# Altium project LF_v5_MainPCB.PrjPcb
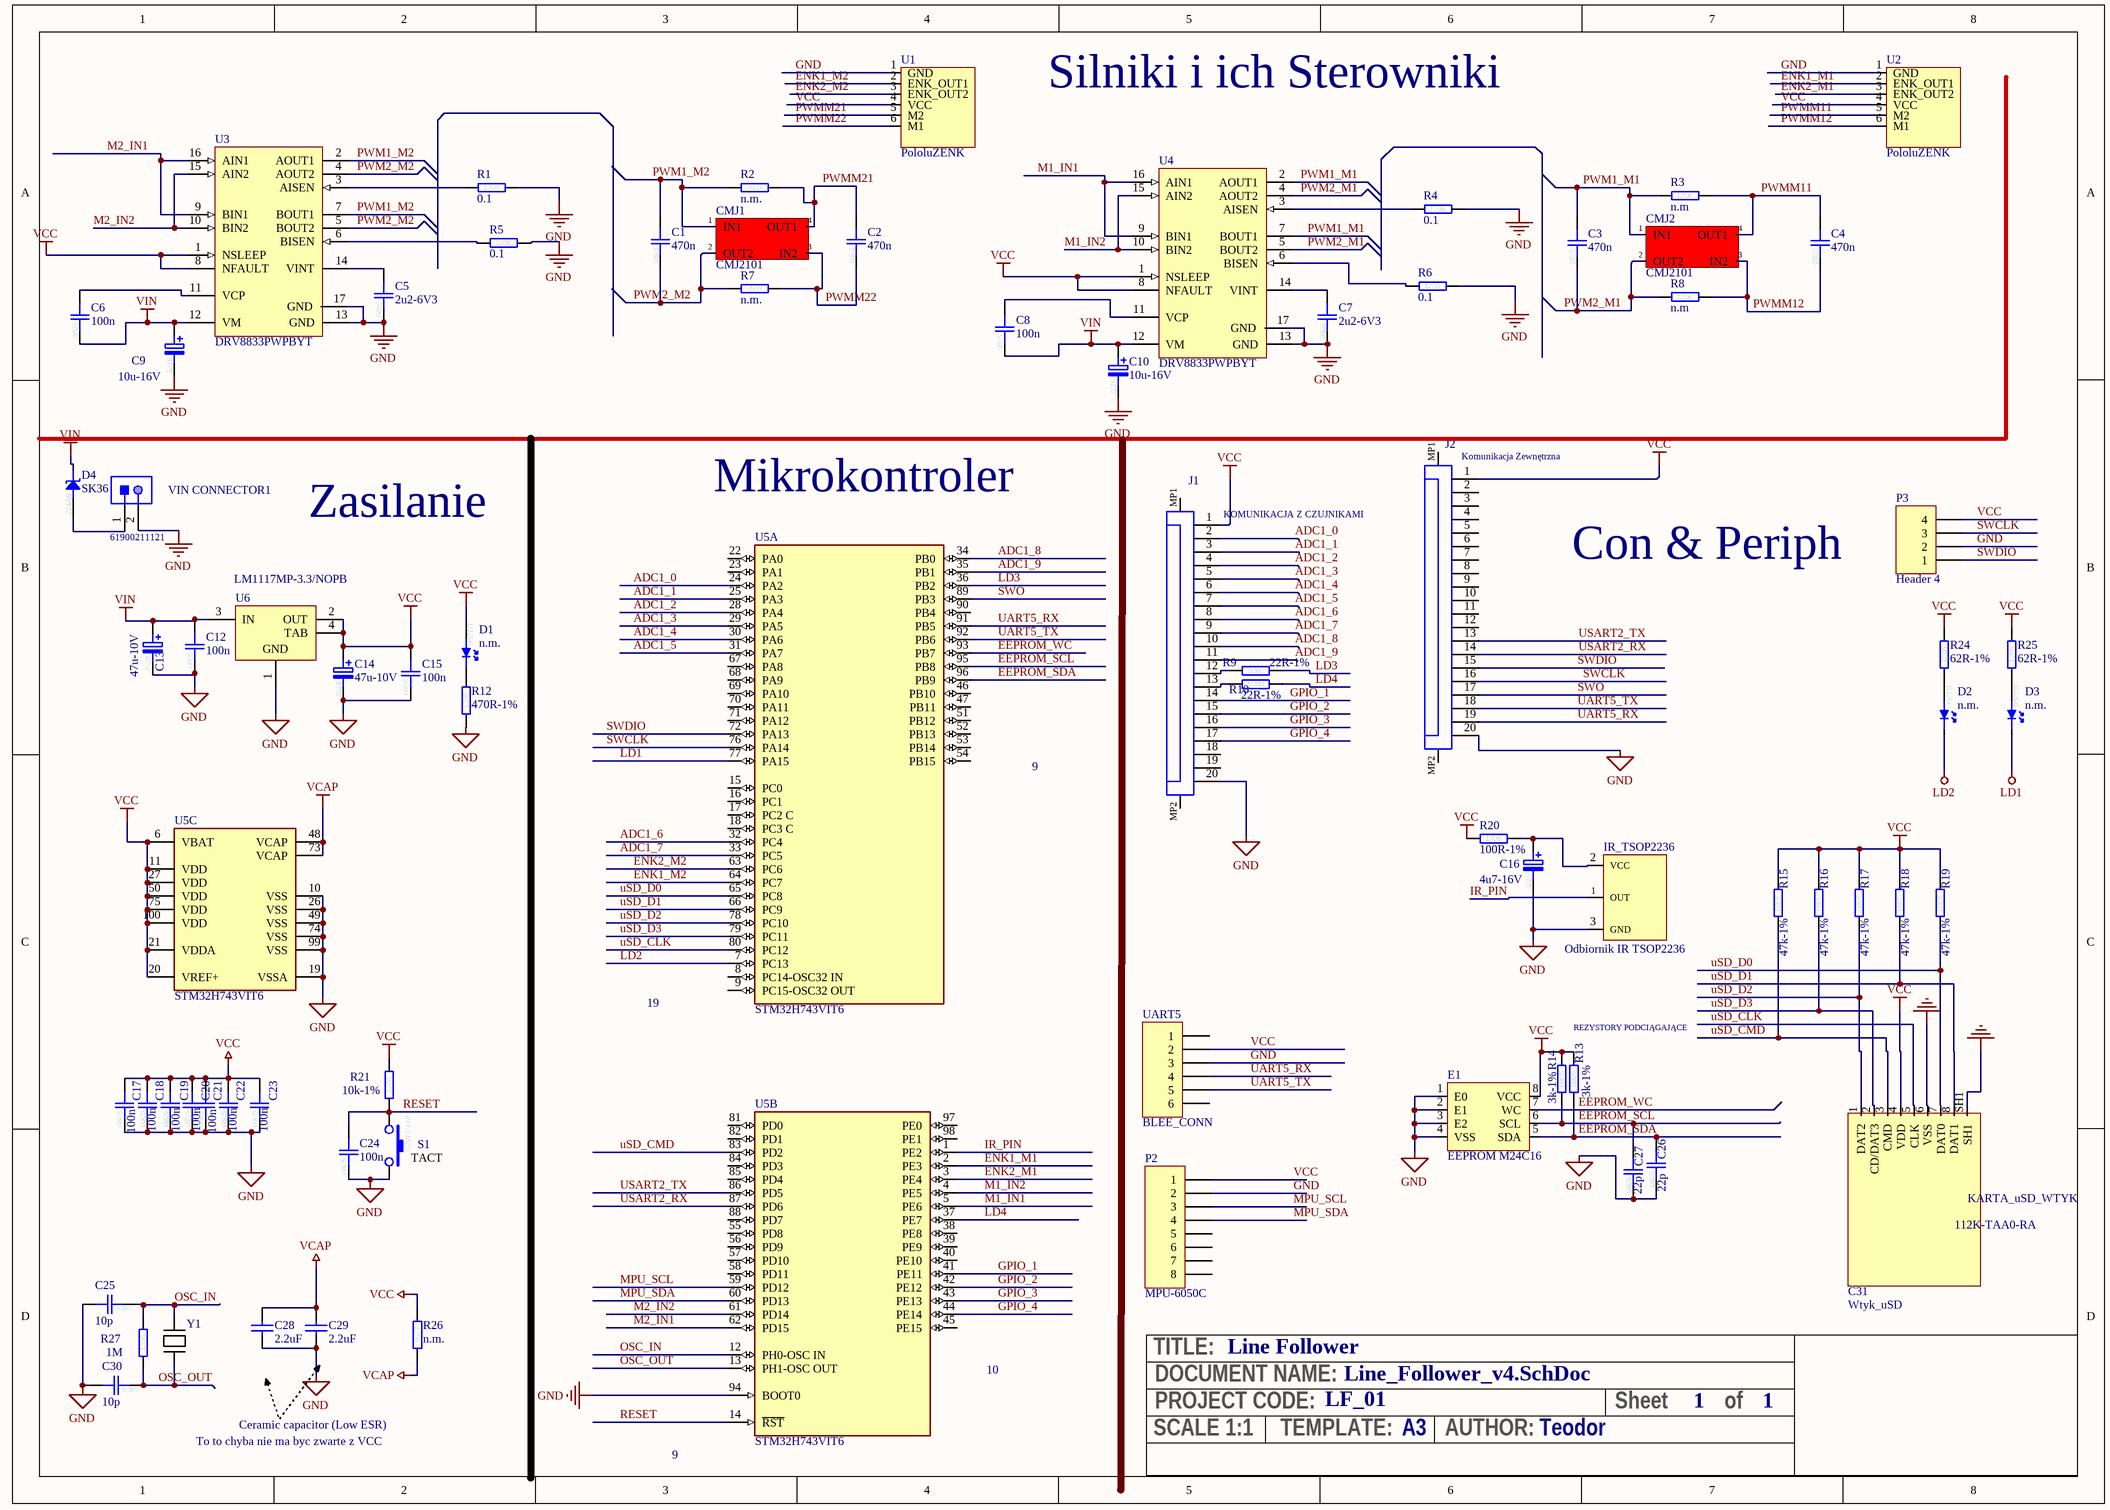
[diagram p0: Line_Follower_v4.SchDoc]
6 sheets, 152 parts. Net scope: hierarchical (ports join the sheet entries above them; power ports are global).
Board file: LF_v5.PcbDoc
Sheets:
  Line_Follower_v4.SchDoc
  Line_Follower_v5.SchDoc
    Connectors = Connectors&Periph.SchDoc
    Motor_Driver = Motor_Driver.SchDoc
    Microcontroller = Microcontroller.SchDoc
    Power = Power.SchDoc

## Sheet Line_Follower_v4.SchDoc: Line Follower
size A3; Autor: Teodor; Dopisek: Cel:; Cel: Ehh; Projektant: Teodor; Author: Teodor; DocumentNumber: 1; SheetNumber: 1; SheetTotal: 1; PROJECT CODE: LF_01

### Parts
(Parts that share a designator on the sheet are numbered #1, #2 ... from top to bottom, then left to right.)
C1#1  470n  [0805C]
C2#1  470n  [0805C]
C3#1  470n  [0805C]
C4#1  470n  [0805C]
C5#1  2u2-6V3  [0805C]
C6#1  100n  [0805C]
C7#1  2u2-6V3  [0805C]
C8#1  100n  [0805C]
C9#1  10u-16V  [3216-SMDA]
C10#1  10u-16V  [3216-SMDA]
C12#1  100n  [0805C]
C13#1  47u-10V  [3528-SMDB]
C14#1  47u-10V  [3528-SMDB]
C15#1  100n  [0805C]
C16  4u7-16V  [3216-SMDA]
C17#1  100n  [0805C]
C18#1  100n  [0805C]
C19#1  100n  [0805C]
C20#1  100n  [0805C]
C21#1  100n  [0805C]
C22#1  100n  [0805C]
C23#1  100n  [0805C]
C24#1  100n  [0805C]
C25#1  10p  [0805C]
C26#1  22p  [0805C]
C27#1  22p  [0805C]
C28#1  2.2uF  [1206C]
C29#1  2.2uF  [1206C]
C30#1  10p  [0805C]
C31  Wtyk_uSD  [112K-TAA0-RA1]
CMJ1#1  CMJ2101  [CMJ2101FP]
CMJ2#1  CMJ2101  [CMJ2101FP]
D1#1  n.m.  [D1206]  (no BOM)
D2#1  n.m.  [D1206]  (no BOM)
D3#1  n.m.  [D1206]  (no BOM)
D4#1  SK36  [DO214AB]
E1#1  EEPROM M24C16  [SOP8EEPROM]
IR_TSOP2236#1  Odbiornik IR TSOP2236  [TSOP2236FP]
J1#1  KOMUNIKACJA Z CZUJNIKAMI  [687120183722]
J2#1  Komunikacja Zewnętrzna  [687120183722]
P2#1  MPU-6050C  [HDR1X8]
P3#1  Header 4  [HDR1X4]
R1#1  0.1  [1206R]
R2#1  n.m.  [0603R]  (no BOM)
R3#1  n.m  [1206R]
R4#1  0.1  [1206R]
R5#1  0.1  [1206R]
R6#1  0.1  [1206R]
R7#1  n.m.  [0603R]  (no BOM)
R8#1  n.m  [1206R]
R9#1  22R-1%  [0805R]
R10#1  22R-1%  [0805R]
R12#1  470R-1%  [1206R]
R13#1  3k-1%  [0805R]
R14#1  3k-1%  [0805R]
R15#1  47k-1%  [0805R]
R16#1  47k-1%  [0805R]
R17#1  47k-1%  [0805R]
R18#1  47k-1%  [0805R]
R19#1  47k-1%  [0805R]
R20#1  100R-1%  [1206R]
R21#1  10k-1%  [1206R]
R24#1  62R-1%  [1206R]
R25#1  62R-1%  [1206R]
R26#1  n.m.  [1206R]  (no BOM)
R27#1  1M  [1206R]
S1#1  TACT  [INT-1187S_16]
U1#1  PololuZENK  [PololuzENK]
U2#1  PololuZENK  [PololuzENK]
U3#1  DRV8833PWPBYT  [DRV8833PWPBYTEOR]
U4#1  DRV8833PWPBYT  [DRV8833PWPBYTEOR]
U5#1  STM32H743VIT6  [FP-LQFP100-1L-MFG]  (parts A,B,C of 3)
U6#1  LM1117MP-3.3/NOPB  [DCY0004A_L]
UART5#1  BLEE_CONN  [HDR1X6]
VIN_CONNECTOR1#1  61900211121  [61900211121]
Y1#1  Rezonator_z_Botland  [Rezonator_z_Botlandu]  (value not drawn)

### Nets
GND: C5#1.2 C7#1.2 C9#1.2 C10#1.2 C12#1.2 C13#1.2 C14#1.2 C15#1.2 C16.2 C17#1.2 C18#1.2 C19#1.2 C20#1.2 C21#1.2 C22#1.2 C23#1.2 C24#1.2 C25#1.1 C26#1.2 C27#1.2 C28#1.1 C29#1.1 C30#1.1 C31.6(VSS) C31.SH1 E1#1.1(E0) E1#1.2(E1) E1#1.3(E2) E1#1.4(VSS) IR_TSOP2236#1.3(GND) J1#1.20 J2#1.20 P2#1.2 P3#1.2 R1#1.2 R4#1.2 R5#1.2 R6#1.2 R12#1.2 S1#1.2 U1#1.1(GND) U2#1.1(GND) U3#1.13(GND) U3#1.17(GND) U4#1.13(GND) U4#1.17(GND) U5#1.10(VSS) U5#1.19(VSSA) U5#1.26(VSS) U5#1.49(VSS) U5#1.74(VSS) U5#1.94(BOOT0) U5#1.99(VSS) U6#1.1(GND) UART5#1.3 VIN_CONNECTOR1#1.2
LD1: D3#1.1(K) U5#1.77(PA15)
LD2: D2#1.1(K) U5#1.7(PC13)
VCAP: C28#1.2 C29#1.2 R26#1.1 U5#1.48(VCAP) U5#1.73(VCAP)
VCC: C14#1.1 C15#1.1 C17#1.1 C18#1.1 C19#1.1 C20#1.1 C21#1.1 C22#1.1 C23#1.1 C31.4(VDD) D1#1.2(A) E1#1.8(VCC) J1#1.1 J2#1.1 P2#1.1 P3#1.4 R13#1.1 R14#1.1 R15#1.1 R16#1.1 R17#1.1 R18#1.1 R19#1.1 R20#1.1 R21#1.1 R24#1.1 R25#1.1 R26#1.2 U1#1.4(VCC) U2#1.4(VCC) U3#1.1(NSLEEP) U3#1.8(NFAULT) U4#1.1(NSLEEP) U4#1.8(NFAULT) U5#1.6(VBAT) U5#1.11(VDD) U5#1.20(VREF+) U5#1.21(VDDA) U5#1.27(VDD) U5#1.50(VDD) U5#1.75(VDD) U5#1.100(VDD) U6#1.2(OUT) U6#1.4(TAB) UART5#1.2
VIN: C6#1.2 C8#1.2 C9#1.1 C10#1.1 C12#1.1 C13#1.1 D4#1.1(K) U3#1.12(VM) U4#1.12(VM) U6#1.3(IN)
ADC1_0: J1#1.2 U5#1.24(PA2)
ADC1_1: J1#1.3 U5#1.25(PA3)
ADC1_2: J1#1.4 U5#1.28(PA4)
ADC1_3: J1#1.5 U5#1.29(PA5)
ADC1_4: J1#1.6 U5#1.30(PA6)
ADC1_5: J1#1.7 U5#1.31(PA7)
ADC1_6: J1#1.8 U5#1.32(PC4)
ADC1_7: J1#1.9 U5#1.33(PC5)
ADC1_8: J1#1.10 U5#1.34(PB0)
ADC1_9: J1#1.11 U5#1.35(PB1)
EEPROM_SCL: C27#1.1 E1#1.6(SCL) R14#1.2 U5#1.95(PB8)
EEPROM_SDA: C26#1.1 E1#1.5(SDA) R13#1.2 U5#1.96(PB9)
EEPROM_WC: E1#1.7(WC) U5#1.93(PB7)
ENK1_M1: U2#1.2(ENK_OUT1) U5#1.2(PE3)
ENK1_M2: U1#1.2(ENK_OUT1) U5#1.64(PC7)
ENK2_M1: U2#1.3(ENK_OUT2) U5#1.3(PE4)
ENK2_M2: U1#1.3(ENK_OUT2) U5#1.63(PC6)
GPIO_1: J1#1.14 U5#1.41(PE11)
GPIO_2: J1#1.15 U5#1.42(PE12)
GPIO_3: J1#1.16 U5#1.43(PE13)
GPIO_4: J1#1.17 U5#1.44(PE14)
IR_PIN: IR_TSOP2236#1.1(OUT) U5#1.1(PE2)
LD3: R9#1.2 U5#1.36(PB2)
LD4: R10#1.2 U5#1.37(PE7)
M1_IN1: U4#1.9(BIN1) U4#1.16(AIN1) U5#1.5(PE6)
M1_IN2: U4#1.10(BIN2) U4#1.15(AIN2) U5#1.4(PE5)
M2_IN1: U3#1.9(BIN1) U3#1.16(AIN1) U5#1.62(PD15)
M2_IN2: U3#1.10(BIN2) U3#1.15(AIN2) U5#1.61(PD14)
MPU_SCL: P2#1.3 U5#1.59(PD12)
MPU_SDA: P2#1.4 U5#1.60(PD13)
OSC_IN: C25#1.2 R27#1.2 U5#1.12(PH0-OSC_IN) Y1#1.1
OSC_OUT: C30#1.2 R27#1.1 U5#1.13(PH1-OSC_OUT) Y1#1.2
PWM1_M1: C3#1.1 CMJ2#1.1(IN1) R3#1.1 U4#1.2(AOUT1) U4#1.7(BOUT1)
PWM1_M2: C1#1.1 CMJ1#1.1(IN1) R2#1.1 U3#1.2(AOUT1) U3#1.7(BOUT1)
PWM2_M1: C3#1.2 CMJ2#1.2(OUT2) R8#1.1 U4#1.4(AOUT2) U4#1.5(BOUT2)
PWM2_M2: C1#1.2 CMJ1#1.2(OUT2) R7#1.1 U3#1.4(AOUT2) U3#1.5(BOUT2)
PWMM11: C4#1.1 CMJ2#1.4(OUT1) R3#1.2 U2#1.5(M2)
PWMM12: C4#1.2 CMJ2#1.3(IN2) R8#1.2 U2#1.6(M1)
PWMM21: C2#1.1 CMJ1#1.4(OUT1) R2#1.2 U1#1.5(M2)
PWMM22: C2#1.2 CMJ1#1.3(IN2) R7#1.2 U1#1.6(M1)
RESET: C24#1.1 R21#1.2 S1#1.1 U5#1.14(~{RST})
SWCLK: J2#1.16 P3#1.3 U5#1.76(PA14)
SWDIO: J2#1.15 P3#1.1 U5#1.72(PA13)
SWO: J2#1.17 U5#1.89(PB3)
UART5_RX: J2#1.19 U5#1.91(PB5) UART5#1.4
UART5_TX: J2#1.18 U5#1.92(PB6) UART5#1.5
USART2_RX: J2#1.14 U5#1.87(PD6)
USART2_TX: J2#1.13 U5#1.86(PD5)
uSD_CLK: C31.5(CLK) U5#1.80(PC12)
uSD_CMD: C31.3(CMD) R15#1.2 U5#1.83(PD2)
uSD_D0: C31.7(DAT0) R19#1.2 U5#1.65(PC8)
uSD_D1: C31.8(DAT1) R18#1.2 U5#1.66(PC9)
uSD_D2: C31.1(DAT2) R17#1.2 U5#1.78(PC10)
uSD_D3: C31.2(CD/DAT3) R16#1.2 U5#1.79(PC11)
NetC5#1_1: C5#1.1 U3#1.14(VINT)
NetC6#1_1: C6#1.1 U3#1.11(VCP)
NetC7#1_1: C7#1.1 U4#1.14(VINT)
NetC8#1_1: C8#1.1 U4#1.11(VCP)
NetC16_1: C16.1 IR_TSOP2236#1.2(VCC) R20#1.2
NetD1#1_1: D1#1.1(K) R12#1.1
NetD2#1_2: D2#1.2(A) R24#1.2
NetD3#1_2: D3#1.2(A) R25#1.2
NetD4#1_2: D4#1.2(A) VIN_CONNECTOR1#1.1
NetJ1#1_12: J1#1.12 R9#1.1
NetJ1#1_13: J1#1.13 R10#1.1
NetR1#1_1: R1#1.1 U3#1.3(AISEN)
NetR4#1_1: R4#1.1 U4#1.3(AISEN)
NetR5#1_1: R5#1.1 U3#1.6(BISEN)
NetR6#1_1: R6#1.1 U4#1.6(BISEN)

Not connected (* = marked no-connect by the designer): J1#1 18 19 MP1 MP2; J2#1 2 3 4 5 6 7 8 9 10 11 12 MP1 MP2; P2#1 5 6 7 8; U5#1 8(PC14-OSC32_IN) 9(PC15-OSC32_OUT) 15(PC0) 16(PC1) 17(PC2_C) 18(PC3_C) 22(PA0) 23(PA1) 38(PE8) 39(PE9) 40(PE10) 45(PE15) 46(PB10) 47(PB11) 51(PB12) 52(PB13) 53(PB14) 54(PB15) 55(PD8) 56(PD9) 57(PD10) 58(PD11) 67(PA8) 68(PA9) 69(PA10) 70(PA11) 71(PA12) 81(PD0) 82(PD1) 84(PD3) 85(PD4) 88(PD7) 90(PB4) 97(PE0) 98(PE1); UART5#1 1 6

### Notes on the sheet
- Silniki i ich Sterowniki
- Mikrokontroler
- Zasilanie
- Con & Periph
- 9
- 19
- REZYSTORY PODCIĄGAJĄCE
- 10
- To to chyba nie ma byc zwarte z VCC
- Ceramic capacitor (Low ESR)
- TITLE:
- DOCUMENT NAME:
- SCALE 1:1
- PROJECT CODE:
- TEMPLATE:
- A3
- AUTHOR:
- Sheet
- of
- (in symbol 0R12-1%  1206) 1206
- (in symbol 2u2-6V3  0805) 0805
- (in symbol 3k-1%  0805) 0805
- (in symbol 4u7-16V  3216) 3216
- (in symbol 10k-1%  1206) 1206
- (in symbol 10n  0805) 0805
- (in symbol 10p  0805) 0805
- (in symbol 10u-16V  3216) 3216
- (in symbol 22p  0805) 0805
- (in symbol 22R-1%  0805) 0805
- (in symbol 47k-1%  0805) 0805
- (in symbol 47u-10V  3528) 3528
- (in symbol 62R-1%  1206) 1206
- (in symbol 100k-1%  1206) 1206
- (in symbol 100n  0805) 0805
- (in symbol 100R-1%  1206) 1206
- (in symbol 112K-TAA0-RA1) KARTA_uSD_WTYK; 112K-TAA0-RA
- (in symbol 470R-1%  1206) 1206
- (in symbol n.m.  0603) 0603
- (in symbol n.m.  1206) 1206
- (in symbol n.m.  D1206) D1206
- (in symbol SK36  DO214AB) 214AB
- (in symbol TACTDF52H16M250  INT-1187S_16) INT-1187S

### Library data of the parts
C1#1 C2#1 C3#1 C4#1 = 100n  0805: Kond. ceramiczny X7R  50V  10%; Indeks: 5566; Nazwa: 100n
C5#1 C7#1 = 2u2-6V3  0805: Kond. ceramiczny X7R  6V3  10%; Indeks: 20978; Nazwa: 2u2-6V3
C6#1 C8#1 C12#1 C15#1 C24#1 = 100n  0805: Kond. ceramiczny X7R  50V  10%; Indeks: 5566; Nazwa: 100n
C9#1 C10#1 = 10u-16V  3216: Kond. tantalowy  A  16V  20%; Indeks: 12471; Nazwa: 10u-16V
C13#1 C14#1 = 47u-10V  3528: Kond. tantalowy  B  10V  20%; Indeks: 4032; Nazwa: 47u-10V
C16 = 4u7-16V  3216: Kond. tantalowy  A  16V  20%; Indeks: 20462; Nazwa: 4u7-16V
C17#1 C18#1 C19#1 C20#1 C21#1 C22#1 C23#1 = 10n  0805: Kond. ceramiczny X7R  50V  10%; Nazwa: 10n
C25#1 C30#1 = 10p  0805: Kond. ceramiczny NP0  50V; Nazwa: 10p
C26#1 C27#1 = 22p  0805: Kond. ceramiczny NP0  50V; Nazwa: 22p
C28#1 C29#1 = Cap_2.2uF_X7R_10%_1206: Capacitor,2.2uF,16V, X7R,10%,1206,YAGEO; Manuf_Part_1: CC1206KKX7R7BB225; Manuf_Part_2: C1206C225K4RAC; Manuf_2: KEMET; Revision: July-2002: Re-released for DXP Platform.; Value: 2.2uF; Order: CC1206KKX7R7BB225; Manuf_1: YAGEO; ECCN_US/EU: n/a
C31 = 112K-TAA0-RA1
CMJ1#1 CMJ2#1 = CMJ2101: Dlawik 100uH 500mA
D1#1 D2#1 D3#1 = n.m.  D1206: Dioda LED; Index: -; Nazwa: n.m.
D4#1 = SK36  DO214AB: Dioda Schottky  60V  IF=3A  VF=0,75V; Index: 9145; Nazwa: SK36
IR_TSOP2236#1 = TSOP2236: Odbiornik Podczerwieni
J1#1 J2#1 = CMP-1502-01579-1: SMT ZIF Connectors Low Profile WR-FPC, Horizontal, Bottom Contact, pitch 0.5 mm, 20 pins; Manufacturer: Wurth Elektronik; Rated Current: 0.4A; Pin Number: 20; Withstanding Voltage: 250VAC; Contact Resistance: 30mOhm; Working Voltage: 50VAC; Pitch: 0.5mm; Package Reference: 687120183722; Publisher: WurthElektronik; Packaging: TapeandReel; Part Number: 687120183722; Operating Temperature: -25to85degC; Orientation: Horizontal; Datasheet URL: https://katalog.we-online.de/em/datasheet/687120183722.pdf; Contact Design: BottomContact; Manufacturer URL: http://www.we-online.de; Mounting Technology: SMT
P2#1 = Header 8: Header, 8-Pin; LatestRevisionDate: 17-Jul-2002; LatestRevisionNote: Re-released for DXP Platform.; Publisher: Altium Limited
P3#1 = Header 4: Header, 4-Pin; LatestRevisionDate: 17-Jul-2002; LatestRevisionNote: Re-released for DXP Platform.; Publisher: Altium Limited
R1#1 R3#1 R4#1 R5#1 R6#1 R8#1 = 0R12-1%  1206: Rezystor 0,25W; Nazwa: 0R12-1%
R2#1 R7#1 = n.m.  0603: Rezystor 0,063W; Indeks: -; Nazwa: n.m.
R9#1 R10#1 = 22R-1%  0805: Rezystor 0,125W; Nazwa: 22R-1%
R12#1 = 470R-1%  1206: Rezystor 0,25W; Nazwa: 470R-1%
R13#1 R14#1 = 3k-1%  0805: Rezystor 0,125W; Nazwa: 3k-1%
R15#1 R16#1 R17#1 R18#1 R19#1 = 47k-1%  0805: Rezystor 0,125W; Nazwa: 47k-1%
R20#1 = 100R-1%  1206: Rezystor 0,25W; Nazwa: 100R-1%
R21#1 = 10k-1%  1206: Rezystor 0,25W; Nazwa: 10k-1%
R24#1 R25#1 = 62R-1%  1206: Rezystor 0,25W; Nazwa: 62R-1%
R26#1 = n.m.  1206: Rezystor 0,25W; Indeks: -; Nazwa: n.m.
R27#1 = 100k-1%  1206: Rezystor 0,25W; Nazwa: 100k-1%
S1#1 = TACTDF52H16M250  INT-1187S_16: Switch SMD h=1,6mm Innocent  INT-1187S_16; Index: 11540; Nazwa: TACTDF52H16M250
U3#1 U4#1 = DRV8833PWPBYT: Mostek caly by TEOR
U5#1 = CMP-12105-000050-1: IC MCU 32BIT 2MB FLASH 100LQFP; Manufacturer: STMicroelectronics; Number Of Ethernet Channels: 1; Number Of Usb Channels: 2; Number Of A/D Converters: 3; Min Supply Voltage: 1.71V; Ram Size: 1060KBytes; Number Of I2C Channels: 4; Frequency: 480MHz; Number Of Adc Channels: 36; Number Of I/Os: 82; Max Supply Voltage: 3.6V; Number Of Spi Channels: 6; Memory Size: 2MBytes; Max Junction Temp: +125°C; Core Architecture: Arm Cortex-M7; Interface: I2C,SPI,UART,USART,USB,LIN,IrDA,Ethernet,I2S,Other; Number Of Timers/Counters: 20; Data Bus Width: 32bits; Number Of Pwm Channels: 42; Number Of Uart Channels: 9; Standoff Height: 0.05mm; Device Class L1: Integrated Circuits (ICs); ComponentLink2URL: https://www.st.com/resource/en/datasheet/stm32h743vi.pdf; Automotive: No; Memory Type: FLASH; Number Of Cores: 1; Temperature Range Low: -40°C; RoHS: TRUE; Ambient Temperature Range Low: -40°C; ComponentLink2Description: Datasheet; Device Class L2: Embedded Processors and Controllers; Device Class L3: Microcontrollers; Digikey Description: IC MCU 32BIT 2MB FLASH 100LQFP; Temperature Range High: +125°C; Ambient Temperature Range High: +85°C; Package: LQFP100-1L; Temperature: -40°C to +125°C; Category: IC; Ipc Land Pattern Name: QFP50P1600X1600X160-100; Height: 1.6mm; Manufacturer Part Number: STM32H743VIT6; Octopart: https://octopart.com/stm32h743vit6-stmicroelectronics-76372527; Lead Free: Yes
U6#1 = CMP-0062-01638-4: 800mA Low-Dropout Linear Regulator, 4-pin SOT-223, Pb-Free; Manufacturer: Texas Instruments; CompType: LDO IC; PackageTopMarking: XYTT*N05A; High-Reliability: Y; PowerWise: N; ComponentLink1URL: http://www.ti.com/general/docs/lit/getliterature.tsp?genericPartNumber=LM1117-N&fileType=pdf; PinCount: 4; PackageDescription: Molded SOT-223, 6.50 x 3.56 x 1.6mm Body, 4 Lead, 2.3mm Pitch; Code_IPC: SOT223-4; PartNumber: LM1117MP-3.3/NOPB; Code_JEDEC: TO-261-AA; RoHS: Y; PackageReference: DCY0004A; ComponentLink1Description: Datasheet URL
UART5#1 = Header 6: Header, 6-Pin; LatestRevisionDate: 17-Jul-2002; LatestRevisionNote: Re-released for DXP Platform.; Publisher: Altium Limited
VIN_CONNECTOR1#1 = CMP-1502-00584-1: Male Locking Header WR-WTB, THT, Vertical, pitch 2.54 mm, 1 x 2 position; Manufacturer: Wurth Elektronik; Position: 1x2; Contact Resistance: 20mOhm; Working Voltage: 250VAC; Pitch: 2.54mm; Gender: Male; Part Number: 61900211121; Mounting Technology: THT; Operating Temperature: -40to105degC; Orientation: Vertical; Packaging: Bag; Package Reference: 61900211121; Manufacturer URL: http://www.we-online.de; Datasheet URL: https://katalog.we-online.de/em/datasheet/6190xx11121.pdf; Publisher: WurthElektronik

## Sheet Line_Follower_v5.SchDoc: General View
size A4 portrait; Autor: Teodor; Dopisek: Cel:; Cel: Ehh; Projektant: Teodor
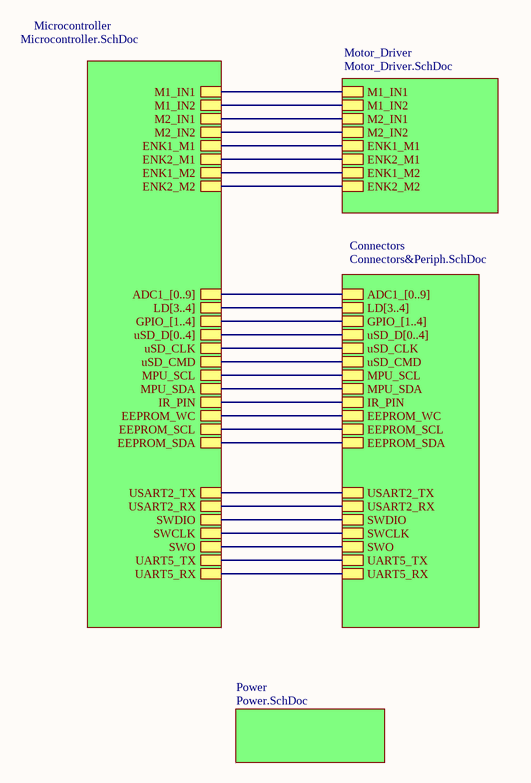
[diagram p1: Line_Follower_v5.SchDoc]

### Sub-sheets
Connectors = Connectors&Periph.SchDoc: ADC1_[0..9], LD[3..4], GPIO_[1..4], uSD_D[0..4], uSD_CLK, uSD_CMD, MPU_SCL, MPU_SDA, IR_PIN, EEPROM_WC, EEPROM_SCL, EEPROM_SDA, USART2_TX, USART2_RX, SWDIO, SWCLK, SWO, UART5_TX, UART5_RX
Microcontroller = Microcontroller.SchDoc: M1_IN1, M1_IN2, M2_IN1, M2_IN2, ENK1_M1, ENK2_M1, ENK1_M2, ENK2_M2, ADC1_[0..9], LD[3..4], GPIO_[1..4], uSD_D[0..4], uSD_CLK, uSD_CMD, MPU_SCL, MPU_SDA, IR_PIN, EEPROM_WC, EEPROM_SCL, EEPROM_SDA, USART2_TX, USART2_RX, SWDIO, SWCLK, SWO, UART5_TX, UART5_RX
Motor_Driver = Motor_Driver.SchDoc: M1_IN1, M1_IN2, M2_IN1, M2_IN2, ENK1_M1, ENK2_M1, ENK1_M2, ENK2_M2
Power = Power.SchDoc: no entries

### Nets
EEPROM_SCL: sheet Connectors/EEPROM_SCL, sheet Microcontroller/EEPROM_SCL
EEPROM_SDA: sheet Connectors/EEPROM_SDA, sheet Microcontroller/EEPROM_SDA
EEPROM_WC: sheet Connectors/EEPROM_WC, sheet Microcontroller/EEPROM_WC
ENK1_M1: sheet Motor_Driver/ENK1_M1, sheet Microcontroller/ENK1_M1
ENK1_M2: sheet Motor_Driver/ENK1_M2, sheet Microcontroller/ENK1_M2
ENK2_M1: sheet Motor_Driver/ENK2_M1, sheet Microcontroller/ENK2_M1
ENK2_M2: sheet Motor_Driver/ENK2_M2, sheet Microcontroller/ENK2_M2
IR_PIN: sheet Connectors/IR_PIN, sheet Microcontroller/IR_PIN
M1_IN1: sheet Motor_Driver/M1_IN1, sheet Microcontroller/M1_IN1
M1_IN2: sheet Motor_Driver/M1_IN2, sheet Microcontroller/M1_IN2
M2_IN1: sheet Motor_Driver/M2_IN1, sheet Microcontroller/M2_IN1
M2_IN2: sheet Motor_Driver/M2_IN2, sheet Microcontroller/M2_IN2
MPU_SCL: sheet Connectors/MPU_SCL, sheet Microcontroller/MPU_SCL
MPU_SDA: sheet Connectors/MPU_SDA, sheet Microcontroller/MPU_SDA
SWCLK: sheet Connectors/SWCLK, sheet Microcontroller/SWCLK
SWDIO: sheet Connectors/SWDIO, sheet Microcontroller/SWDIO
SWO: sheet Connectors/SWO, sheet Microcontroller/SWO
UART5_RX: sheet Connectors/UART5_RX, sheet Microcontroller/UART5_RX
UART5_TX: sheet Connectors/UART5_TX, sheet Microcontroller/UART5_TX
USART2_RX: sheet Connectors/USART2_RX, sheet Microcontroller/USART2_RX
USART2_TX: sheet Connectors/USART2_TX, sheet Microcontroller/USART2_TX
uSD_CLK: sheet Connectors/uSD_CLK, sheet Microcontroller/uSD_CLK
uSD_CMD: sheet Connectors/uSD_CMD, sheet Microcontroller/uSD_CMD

### Buses and harness runs
bus sheet Connectors/ADC1_[0..9] = sheet Microcontroller/ADC1_[0..9]
bus sheet Connectors/GPIO_[1..4] = sheet Microcontroller/GPIO_[1..4]
bus sheet Connectors/LD[3..4] = sheet Microcontroller/LD[3..4]
bus sheet Connectors/uSD_D[0..4] = sheet Microcontroller/uSD_D[0..4]

### Notes on the sheet
- Tytuł:
- Rozmiar:
- Data:
- A4
- Designed by:
- Czas:
- Część
- z

## Sheet Connectors&Periph.SchDoc: Hi
size A4 portrait; Cel: Ehh; Projektant: Teodor
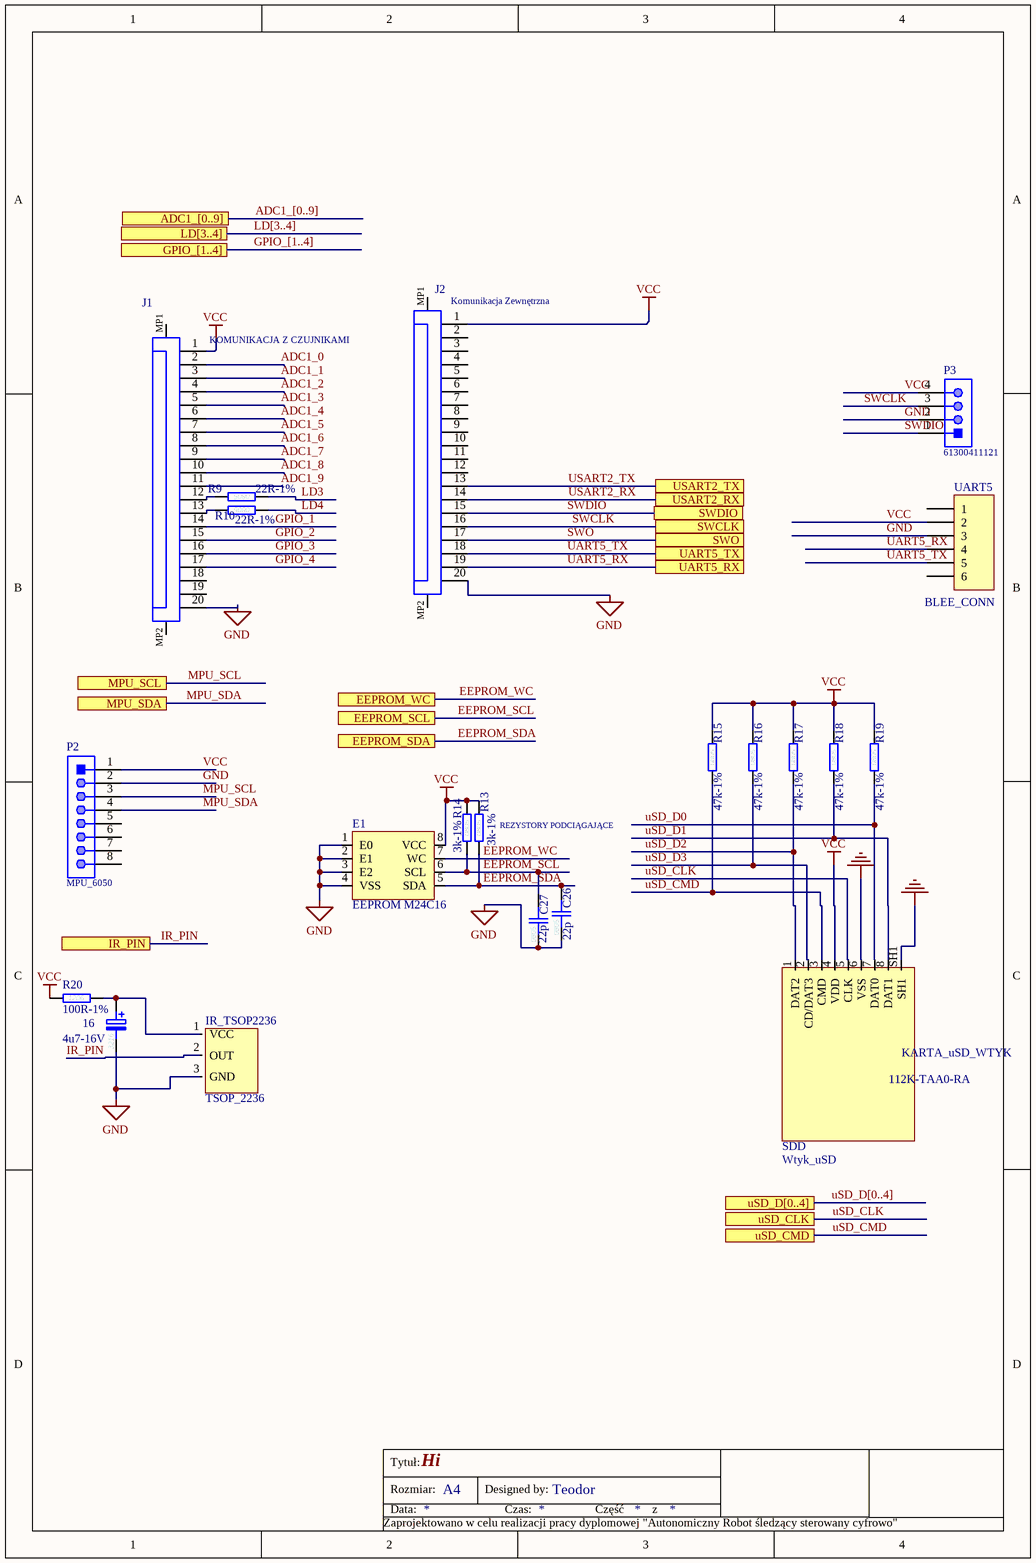
[diagram p2: Connectors&Periph.SchDoc]

### Parts
(Parts that share a designator on the sheet are numbered #1, #2 ... from top to bottom, then left to right.)
16  4u7-16V  [3216-SMDA]
C26#2  22p  [0805C]
C27#2  22p  [0805C]
E1#2  EEPROM M24C16  [SOP8EEPROM]
IR_TSOP2236#2  TSOP_2236  [TSOP2236+high]
J1#2  KOMUNIKACJA Z CZUJNIKAMI  [687120183722]
J2#2  Komunikacja Zewnętrzna  [687120183722]
P2#2  MPU_6050  [61300811121]
P3#2  61300411121  [61300411121]
R9#2  22R-1%  [0805R]
R10#2  22R-1%  [0805R]
R13#2  3k-1%  [0805R]
R14#2  3k-1%  [0805R]
R15#2  47k-1%  [0805R]
R16#2  47k-1%  [0805R]
R17#2  47k-1%  [0805R]
R18#2  47k-1%  [0805R]
R19#2  47k-1%  [0805R]
R20#2  100R-1%  [1206R]
SDD  Wtyk_uSD  [112K-TAA0-RA1]
UART5#2  BLEE_CONN  [HDR1X6]

### Ports
ADC1_[0..9], EEPROM_SCL, EEPROM_SDA, EEPROM_WC, GPIO_[1..4], IR_PIN, LD[3..4], MPU_SCL, MPU_SDA, SWCLK, SWDIO, SWO, UART5_RX, UART5_TX, USART2_RX, USART2_TX, uSD_CLK, uSD_CMD, uSD_D[0..4]

### Nets
GND: 16.2 C26#2.2 C27#2.2 E1#2.1(E0) E1#2.2(E1) E1#2.3(E2) E1#2.4(VSS) IR_TSOP2236#2.3(GND) J1#2.20 J2#2.20 P2#2.2 P3#2.2 SDD.6(VSS) SDD.SH1 UART5#2.3
VCC: E1#2.8(VCC) J1#2.1 J2#2.1 P2#2.1 P3#2.4 R13#2.1 R14#2.1 R15#2.1 R16#2.1 R17#2.1 R18#2.1 R19#2.1 R20#2.1 SDD.4(VDD) UART5#2.2
ADC1_0: J1#2.2
ADC1_1: J1#2.3
ADC1_2: J1#2.4
ADC1_3: J1#2.5
ADC1_4: J1#2.6
ADC1_5: J1#2.7
ADC1_6: J1#2.8
ADC1_7: J1#2.9
ADC1_8: J1#2.10
ADC1_9: J1#2.11
EEPROM_SCL: C27#2.1 E1#2.6(SCL) R14#2.2 ; port EEPROM_SCL
EEPROM_SDA: C26#2.1 E1#2.5(SDA) R13#2.2 ; port EEPROM_SDA
EEPROM_WC: E1#2.7(WC) ; port EEPROM_WC
GPIO_1: J1#2.14
GPIO_2: J1#2.15
GPIO_3: J1#2.16
GPIO_4: J1#2.17
IR_PIN: IR_TSOP2236#2.2(OUT) ; port IR_PIN
LD3: R9#2.2
LD4: R10#2.2
MPU_SCL: P2#2.3 ; port MPU_SCL
MPU_SDA: P2#2.4 ; port MPU_SDA
SWCLK: J2#2.16 P3#2.3 ; port SWCLK
SWDIO: J2#2.15 P3#2.1 ; port SWDIO
SWO: J2#2.17 ; port SWO
UART5_RX: J2#2.19 UART5#2.4 ; port UART5_RX
UART5_TX: J2#2.18 UART5#2.5 ; port UART5_TX
USART2_RX: J2#2.14 ; port USART2_RX
USART2_TX: J2#2.13 ; port USART2_TX
uSD_CLK: SDD.5(CLK) ; port uSD_CLK
uSD_CMD: R15#2.2 SDD.3(CMD) ; port uSD_CMD
uSD_D0: R19#2.2 SDD.7(DAT0)
uSD_D1: R18#2.2 SDD.8(DAT1)
uSD_D2: R17#2.2 SDD.1(DAT2)
uSD_D3: R16#2.2 SDD.2(CD/DAT3)
Net16_1: 16.1 IR_TSOP2236#2.1(VCC) R20#2.2
NetJ1#2_12: J1#2.12 R9#2.1
NetJ1#2_13: J1#2.13 R10#2.1

Not connected (* = marked no-connect by the designer): J1#2 18 19 MP1 MP2; J2#2 2 3 4 5 6 7 8 9 10 11 12 MP1 MP2; P2#2 5 6 7 8; UART5#2 1 6

### Buses and harness runs
bus ADC1_[0..9] = port ADC1_[0..9]
bus GPIO_[1..4] = port GPIO_[1..4]
bus LD[3..4] = port LD[3..4]
bus uSD_D[0..4] = port uSD_D[0..4]

### Notes on the sheet
- REZYSTORY PODCIĄGAJĄCE
- Tytuł:
- Rozmiar:
- Data:
- A4
- Designed by:
- Czas:
- Część
- z
- Zaprojektowano w celu realizacji pracy dyplomowej "Autonomiczny Robot śledzący sterowany cyfrowo"
- (in symbol 3k-1%  0805) 0805
- (in symbol 4u7-16V  3216) 3216
- (in symbol 22p  0805) 0805
- (in symbol 22R-1%  0805) 0805
- (in symbol 47k-1%  0805) 0805
- (in symbol 100R-1%  1206) 1206
- (in symbol 112K-TAA0-RA1) KARTA_uSD_WTYK; 112K-TAA0-RA

### Library data of the parts
16 = 4u7-16V  3216: as C16 on sheet Line_Follower_v4; Nazwa: 4u7-16V
C26#2 C27#2 = 22p  0805: Kond. ceramiczny NP0  50V; Nazwa: 22p
J1#2 J2#2 = CMP-1502-01579-1: as J1#1 on sheet Line_Follower_v4; Package Reference: 687120183722; Publisher: WurthElektronik; Packaging: TapeandReel; Part Number: 687120183722; Operating Temperature: -25to85degC; Orientation: Horizontal; Datasheet URL: https://katalog.we-online.de/em/datasheet/687120183722.pdf; Contact Design: BottomContact; Manufacturer URL: http://www.we-online.de; Mounting Technology: SMT
P2#2 = CMP-1502-01076-1: THT Vertical Pin Header WR-PHD, Pitch 2.54 mm, Single Row, 8 pins; Manufacturer: Wurth Elektronik; Rated Current: 3A; Pin Number: 8; Working Voltage: 250VAC; Gender: Male; Contact Resistance: 20mOhm; Pitch: 2.54mm; Withstanding Voltage: 500VAC; Publisher: WurthElektronik; Operating Temperature: -40to105degC; Orientation: Vertical; Row Number: Single; Part Number: 61300811121; Package Reference: 61300811121; Mounting Technology: THT; Packaging: Bag; Manufacturer URL: http://www.we-online.de; Datasheet URL: https://katalog.we-online.de/em/datasheet/6130xx11121.pdf
P3#2 = CMP-1502-01064-1: SWD; Manufacturer: Wurth Elektronik; Withstanding Voltage: 500VAC; Rated Current: 3A; Working Voltage: 250VAC; Pin Number: 4; Gender: Male; Row Number: Single; Contact Resistance: 20mOhm; Pitch: 2.54mm; Manufacturer URL: http://www.we-online.de; Operating Temperature: -40to105degC; Packaging: Bag; Mounting Technology: THT; Package Reference: 61300411121; Datasheet URL: https://katalog.we-online.de/em/datasheet/6130xx11121.pdf; Publisher: WurthElektronik; Part Number: 61300411121; Orientation: Vertical
R9#2 R10#2 = 22R-1%  0805: Rezystor 0,125W; Nazwa: 22R-1%
R13#2 R14#2 = 3k-1%  0805: Rezystor 0,125W; Nazwa: 3k-1%
R15#2 R16#2 R17#2 R18#2 R19#2 = 47k-1%  0805: Rezystor 0,125W; Nazwa: 47k-1%
R20#2 = 100R-1%  1206: Rezystor 0,25W; Nazwa: 100R-1%
SDD = 112K-TAA0-RA1
UART5#2 = Header 6: Header, 6-Pin; LatestRevisionDate: 17-Jul-2002; LatestRevisionNote: Re-released for DXP Platform.; Publisher: Altium Limited

## Sheet Motor_Driver.SchDoc: Sterownik Silników
size A4 portrait; SheetNumber: 4; SheetTotal: 5; Cel: Ehh; Projektant: Teodor
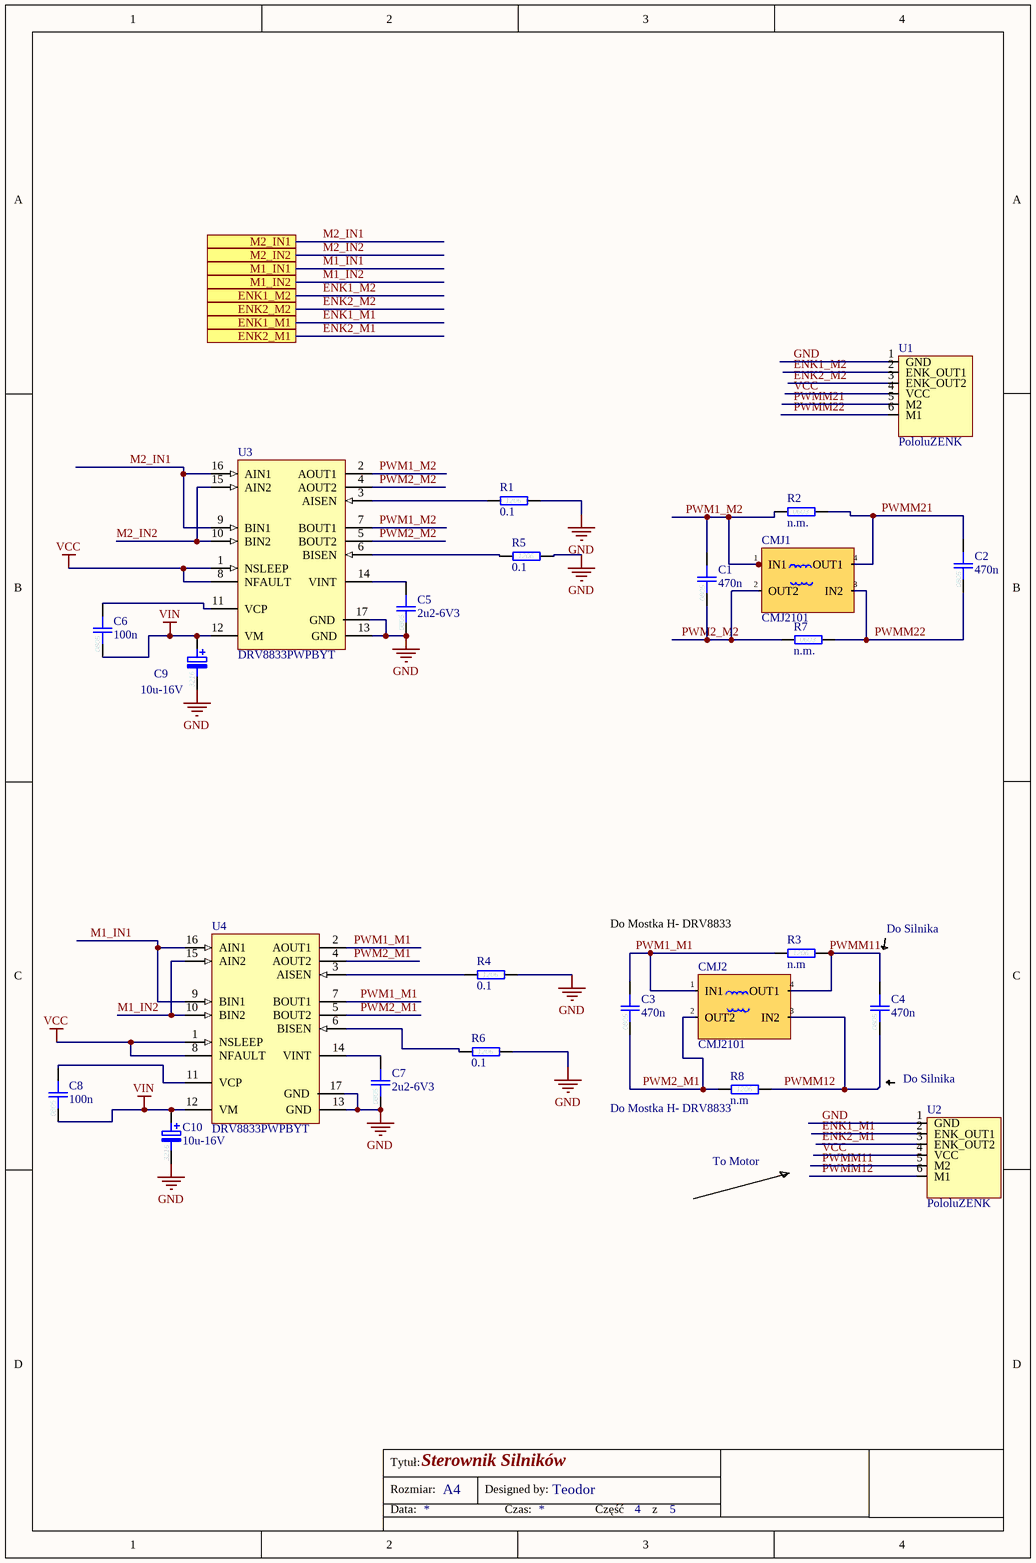
[diagram p3: Motor_Driver.SchDoc]

### Parts
(Parts that share a designator on the sheet are numbered #1, #2 ... from top to bottom, then left to right.)
C1#2  470n  [0805C]
C2#2  470n  [0805C]
C3#2  470n  [0805C]
C4#2  470n  [0805C]
C5#2  2u2-6V3  [0805C]
C6#2  100n  [0805C]
C7#2  2u2-6V3  [0805C]
C8#2  100n  [0805C]
C9#2  10u-16V  [3216-SMDA]
C10#2  10u-16V  [3216-SMDA]
CMJ1#2  CMJ2101  [CMJ2101FP]
CMJ2#2  CMJ2101  [CMJ2101FP]
R1#2  0.1  [1206R]
R2#2  n.m.  [0603R]  (no BOM)
R3#2  n.m  [1206R]
R4#2  0.1  [1206R]
R5#2  0.1  [1206R]
R6#2  0.1  [1206R]
R7#2  n.m.  [0603R]  (no BOM)
R8#2  n.m  [1206R]
U1#2  PololuZENK  [PololuzENK]
U2#2  PololuZENK  [PololuzENK]
U3#2  DRV8833PWPBYT  [DRV8833PWPBYTEOR]
U4#2  DRV8833PWPBYT  [DRV8833PWPBYTEOR]

### Ports
ENK1_M1, ENK1_M2, ENK2_M1, ENK2_M2, M1_IN1, M1_IN2, M2_IN1, M2_IN2

### Nets
GND: C5#2.2 C7#2.2 C9#2.2 C10#2.2 R1#2.2 R4#2.2 R5#2.2 R6#2.2 U1#2.1(GND) U2#2.1(GND) U3#2.13(GND) U3#2.17(GND) U4#2.13(GND) U4#2.17(GND)
VCC: U1#2.4(VCC) U2#2.4(VCC) U3#2.1(NSLEEP) U3#2.8(NFAULT) U4#2.1(NSLEEP) U4#2.8(NFAULT)
VIN: C6#2.2 C8#2.2 C9#2.1 C10#2.1 U3#2.12(VM) U4#2.12(VM)
ENK1_M1: U2#2.2(ENK_OUT1) ; port ENK1_M1
ENK1_M2: U1#2.2(ENK_OUT1) ; port ENK1_M2
ENK2_M1: U2#2.3(ENK_OUT2) ; port ENK2_M1
ENK2_M2: U1#2.3(ENK_OUT2) ; port ENK2_M2
M1_IN1: U4#2.9(BIN1) U4#2.16(AIN1) ; port M1_IN1
M1_IN2: U4#2.10(BIN2) U4#2.15(AIN2) ; port M1_IN2
M2_IN1: U3#2.9(BIN1) U3#2.16(AIN1) ; port M2_IN1
M2_IN2: U3#2.10(BIN2) U3#2.15(AIN2) ; port M2_IN2
PWM1_M1: C3#2.1 CMJ2#2.1(IN1) R3#2.1 U4#2.2(AOUT1) U4#2.7(BOUT1)
PWM1_M2: C1#2.1 CMJ1#2.1(IN1) R2#2.1 U3#2.2(AOUT1) U3#2.7(BOUT1)
PWM2_M1: C3#2.2 CMJ2#2.2(OUT2) R8#2.1 U4#2.4(AOUT2) U4#2.5(BOUT2)
PWM2_M2: C1#2.2 CMJ1#2.2(OUT2) R7#2.1 U3#2.4(AOUT2) U3#2.5(BOUT2)
PWMM11: C4#2.1 CMJ2#2.4(OUT1) R3#2.2 U2#2.5(M2)
PWMM12: C4#2.2 CMJ2#2.3(IN2) R8#2.2 U2#2.6(M1)
PWMM21: C2#2.1 CMJ1#2.4(OUT1) R2#2.2 U1#2.5(M2)
PWMM22: C2#2.2 CMJ1#2.3(IN2) R7#2.2 U1#2.6(M1)
NetC5#2_1: C5#2.1 U3#2.14(VINT)
NetC6#2_1: C6#2.1 U3#2.11(VCP)
NetC7#2_1: C7#2.1 U4#2.14(VINT)
NetC8#2_1: C8#2.1 U4#2.11(VCP)
NetR1#2_1: R1#2.1 U3#2.3(AISEN)
NetR4#2_1: R4#2.1 U4#2.3(AISEN)
NetR5#2_1: R5#2.1 U3#2.6(BISEN)
NetR6#2_1: R6#2.1 U4#2.6(BISEN)

### Notes on the sheet
- Do Mostka H- DRV8833
- Do Silnika
- (near R8#2) Do Mostka H- DRV8833
- To Motor
- Tytuł:
- Rozmiar:
- Data:
- A4
- Designed by:
- Czas:
- Część
- z
- (in symbol 0R12-1%  1206) 1206
- (in symbol 2u2-6V3  0805) 0805
- (in symbol 10u-16V  3216) 3216
- (in symbol 100n  0805) 0805
- (in symbol n.m.  0603) 0603

### Library data of the parts
C1#2 C2#2 C3#2 C4#2 = 100n  0805: as C1#1 on sheet Line_Follower_v4
C5#2 C7#2 = 2u2-6V3  0805: as C5#1 on sheet Line_Follower_v4; Nazwa: 2u2-6V3
C6#2 C8#2 = 100n  0805: as C6#1 on sheet Line_Follower_v4; Nazwa: 100n
C9#2 C10#2 = 10u-16V  3216: as C9#1 on sheet Line_Follower_v4; Nazwa: 10u-16V
CMJ1#2 CMJ2#2 = CMJ2101: Dlawik 100uH 500mA
R1#2 R3#2 R4#2 R5#2 R6#2 R8#2 = 0R12-1%  1206: Rezystor 0,25W; Nazwa: 0R12-1%
R2#2 R7#2 = n.m.  0603: Rezystor 0,063W; Indeks: -; Nazwa: n.m.
U3#2 U4#2 = DRV8833PWPBYT: Mostek caly by TEOR

## Sheet Microcontroller.SchDoc: HI
size A4 portrait; Cel: Ehh; Projektant: Teodor
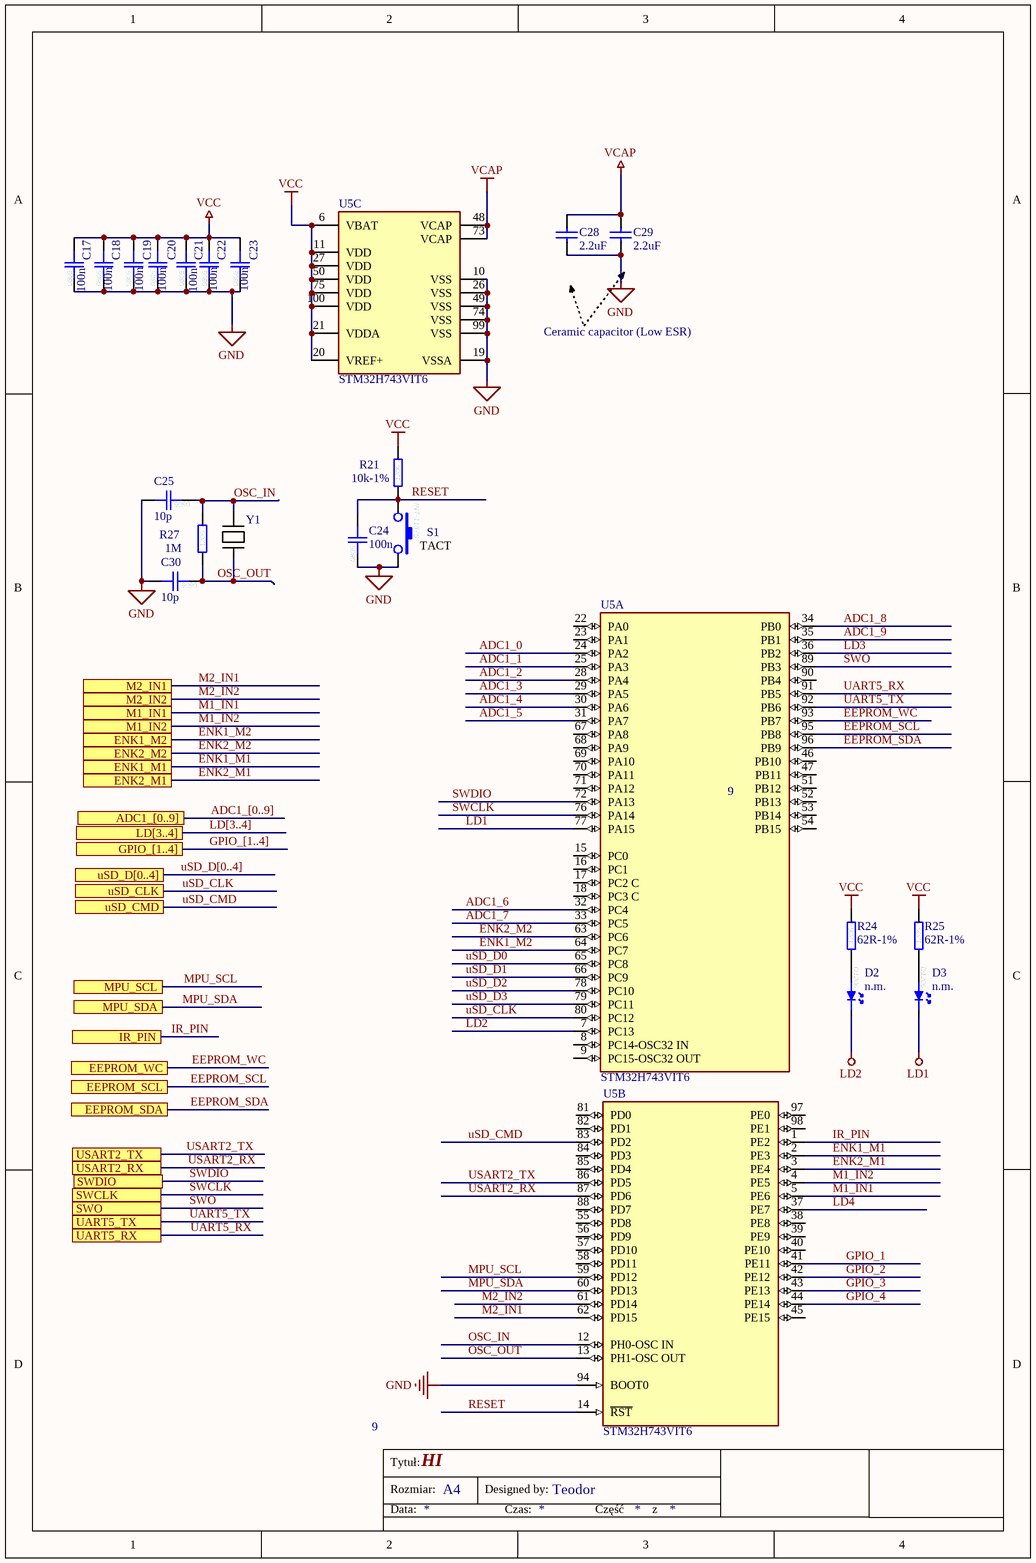
[diagram p4: Microcontroller.SchDoc]

### Parts
(Parts that share a designator on the sheet are numbered #1, #2 ... from top to bottom, then left to right.)
C17#2  100n  [0805C]
C18#2  100n  [0805C]
C19#2  100n  [0805C]
C20#2  100n  [0805C]
C21#2  100n  [0805C]
C22#2  100n  [0805C]
C23#2  100n  [0805C]
C24#2  100n  [0805C]
C25#2  10p  [0805C]
C28#2  2.2uF  [1206C]
C29#2  2.2uF  [1206C]
C30#2  10p  [0805C]
D2#2  n.m.  [D1206]  (no BOM)
D3#2  n.m.  [D1206]  (no BOM)
R21#2  10k-1%  [1206R]
R24#2  62R-1%  [1206R]
R25#2  62R-1%  [1206R]
R27#2  1M  [1206R]
S1#2  TACT  [INT-1187S_16]
U5#2  STM32H743VIT6  [FP-LQFP100-1L-MFG]  (parts A,B,C of 3)
Y1#2  Rezonator_z_Botland  [Rezonator_z_Botlandu]  (value not drawn)

### Ports
ADC1_[0..9], EEPROM_SCL, EEPROM_SDA, EEPROM_WC, ENK1_M1, ENK1_M2, ENK2_M1, ENK2_M2, GPIO_[1..4], IR_PIN, LD[3..4], M1_IN1, M1_IN2, M2_IN1, M2_IN2, MPU_SCL, MPU_SDA, SWCLK, SWDIO, SWO, UART5_RX, UART5_TX, USART2_RX, USART2_TX, uSD_CLK, uSD_CMD, uSD_D[0..4]

### Nets
GND: C17#2.2 C18#2.2 C19#2.2 C20#2.2 C21#2.2 C22#2.2 C23#2.2 C24#2.2 C25#2.1 C28#2.1 C29#2.1 C30#2.1 S1#2.2 U5#2.10(VSS) U5#2.19(VSSA) U5#2.26(VSS) U5#2.49(VSS) U5#2.74(VSS) U5#2.94(BOOT0) U5#2.99(VSS)
LD1: D3#2.1(K) U5#2.77(PA15)
LD2: D2#2.1(K) U5#2.7(PC13)
VCAP: C28#2.2 C29#2.2 U5#2.48(VCAP) U5#2.73(VCAP)
VCC: C17#2.1 C18#2.1 C19#2.1 C20#2.1 C21#2.1 C22#2.1 C23#2.1 R21#2.1 R24#2.1 R25#2.1 U5#2.6(VBAT) U5#2.11(VDD) U5#2.20(VREF+) U5#2.21(VDDA) U5#2.27(VDD) U5#2.50(VDD) U5#2.75(VDD) U5#2.100(VDD)
ADC1_0: U5#2.24(PA2)
ADC1_1: U5#2.25(PA3)
ADC1_2: U5#2.28(PA4)
ADC1_3: U5#2.29(PA5)
ADC1_4: U5#2.30(PA6)
ADC1_5: U5#2.31(PA7)
ADC1_6: U5#2.32(PC4)
ADC1_7: U5#2.33(PC5)
ADC1_8: U5#2.34(PB0)
ADC1_9: U5#2.35(PB1)
EEPROM_SCL: U5#2.95(PB8) ; port EEPROM_SCL
EEPROM_SDA: U5#2.96(PB9) ; port EEPROM_SDA
EEPROM_WC: U5#2.93(PB7) ; port EEPROM_WC
ENK1_M1: U5#2.2(PE3) ; port ENK1_M1
ENK1_M2: U5#2.64(PC7) ; port ENK1_M2
ENK2_M1: U5#2.3(PE4) ; port ENK2_M1
ENK2_M2: U5#2.63(PC6) ; port ENK2_M2
GPIO_1: U5#2.41(PE11)
GPIO_2: U5#2.42(PE12)
GPIO_3: U5#2.43(PE13)
GPIO_4: U5#2.44(PE14)
IR_PIN: U5#2.1(PE2) ; port IR_PIN
LD3: U5#2.36(PB2)
LD4: U5#2.37(PE7)
M1_IN1: U5#2.5(PE6) ; port M1_IN1
M1_IN2: U5#2.4(PE5) ; port M1_IN2
M2_IN1: U5#2.62(PD15) ; port M2_IN1
M2_IN2: U5#2.61(PD14) ; port M2_IN2
MPU_SCL: U5#2.59(PD12) ; port MPU_SCL
MPU_SDA: U5#2.60(PD13) ; port MPU_SDA
OSC_IN: C25#2.2 R27#2.2 U5#2.12(PH0-OSC_IN) Y1#2.1
OSC_OUT: C30#2.2 R27#2.1 U5#2.13(PH1-OSC_OUT) Y1#2.2
RESET: C24#2.1 R21#2.2 S1#2.1 U5#2.14(~{RST})
SWCLK: U5#2.76(PA14) ; port SWCLK
SWDIO: U5#2.72(PA13) ; port SWDIO
SWO: U5#2.89(PB3) ; port SWO
UART5_RX: U5#2.91(PB5) ; port UART5_RX
UART5_TX: U5#2.92(PB6) ; port UART5_TX
USART2_RX: U5#2.87(PD6) ; port USART2_RX
USART2_TX: U5#2.86(PD5) ; port USART2_TX
uSD_CLK: U5#2.80(PC12) ; port uSD_CLK
uSD_CMD: U5#2.83(PD2) ; port uSD_CMD
uSD_D0: U5#2.65(PC8)
uSD_D1: U5#2.66(PC9)
uSD_D2: U5#2.78(PC10)
uSD_D3: U5#2.79(PC11)
NetD2#2_2: D2#2.2(A) R24#2.2
NetD3#2_2: D3#2.2(A) R25#2.2

Not connected (* = marked no-connect by the designer): U5#2 8(PC14-OSC32_IN) 9(PC15-OSC32_OUT) 15(PC0) 16(PC1) 17(PC2_C) 18(PC3_C) 22(PA0) 23(PA1) 38(PE8) 39(PE9) 40(PE10) 45(PE15) 46(PB10) 47(PB11) 51(PB12) 52(PB13) 53(PB14) 54(PB15) 55(PD8) 56(PD9) 57(PD10) 58(PD11) 67(PA8) 68(PA9) 69(PA10) 70(PA11) 71(PA12) 81(PD0) 82(PD1) 84(PD3) 85(PD4) 88(PD7) 90(PB4) 97(PE0) 98(PE1)

### Buses and harness runs
bus ADC1_[0..9] = port ADC1_[0..9]
bus GPIO_[1..4] = port GPIO_[1..4]
bus LD[3..4] = port LD[3..4]
bus uSD_D[0..4] = port uSD_D[0..4]

### Notes on the sheet
- Ceramic capacitor (Low ESR)
- (near U5#2) 9
- 9
- Tytuł:
- Rozmiar:
- Data:
- A4
- Designed by:
- Czas:
- Część
- z
- (in symbol 10k-1%  1206) 1206
- (in symbol 10n  0805) 0805
- (in symbol 10p  0805) 0805
- (in symbol 62R-1%  1206) 1206
- (in symbol 100k-1%  1206) 1206
- (in symbol 100n  0805) 0805
- (in symbol n.m.  D1206) D1206
- (in symbol TACTDF52H16M250  INT-1187S_16) INT-1187S

### Library data of the parts
C17#2 C18#2 C19#2 C20#2 C21#2 C22#2 C23#2 = 10n  0805: as C17#1 on sheet Line_Follower_v4
C24#2 = 100n  0805: as C6#1 on sheet Line_Follower_v4; Nazwa: 100n
C25#2 C30#2 = 10p  0805: Kond. ceramiczny NP0  50V; Nazwa: 10p
C28#2 C29#2 = Cap_2.2uF_X7R_10%_1206: as C28#1 on sheet Line_Follower_v4; Revision: July-2002: Re-released for DXP Platform.; Value: 2.2uF; Order: CC1206KKX7R7BB225; Manuf_1: YAGEO; ECCN_US/EU: n/a
D2#2 D3#2 = n.m.  D1206: Dioda LED; Index: -; Nazwa: n.m.
R21#2 = 10k-1%  1206: Rezystor 0,25W; Nazwa: 10k-1%
R24#2 R25#2 = 62R-1%  1206: Rezystor 0,25W; Nazwa: 62R-1%
R27#2 = 100k-1%  1206: Rezystor 0,25W; Nazwa: 100k-1%
S1#2 = TACTDF52H16M250  INT-1187S_16: as S1#1 on sheet Line_Follower_v4; Nazwa: TACTDF52H16M250
U5#2 = CMP-12105-000050-1: as U5#1 on sheet Line_Follower_v4; Device Class L1: Integrated Circuits (ICs); ComponentLink2URL: https://www.st.com/resource/en/datasheet/stm32h743vi.pdf; Automotive: No; Memory Type: FLASH; Number Of Cores: 1; Temperature Range Low: -40°C; RoHS: TRUE; Ambient Temperature Range Low: -40°C; ComponentLink2Description: Datasheet; Device Class L2: Embedded Processors and Controllers; Device Class L3: Microcontrollers; Digikey Description: IC MCU 32BIT 2MB FLASH 100LQFP; Temperature Range High: +125°C; Ambient Temperature Range High: +85°C; Package: LQFP100-1L; Temperature: -40°C to +125°C; Category: IC; Ipc Land Pattern Name: QFP50P1600X1600X160-100; Height: 1.6mm; Manufacturer Part Number: STM32H743VIT6; Octopart: https://octopart.com/stm32h743vit6-stmicroelectronics-76372527; Lead Free: Yes

## Sheet Power.SchDoc: Power
size A4 portrait; SheetNumber: 2; SheetTotal: 5; Cel: Ehh; Projektant: Teodor
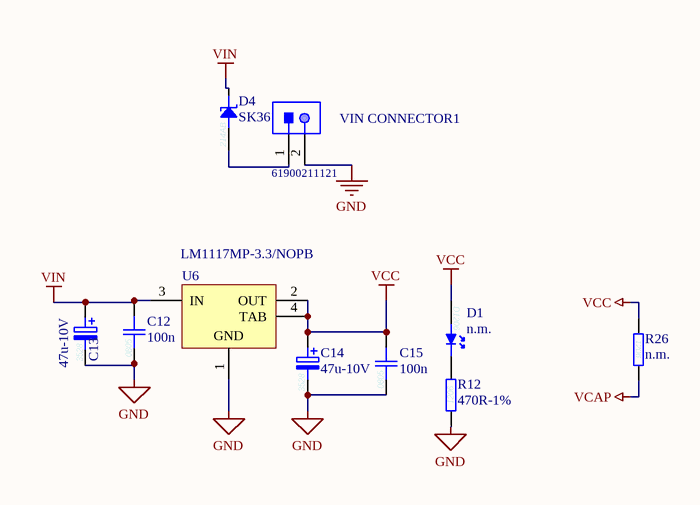
[diagram p5: Power.SchDoc]

### Parts
(Parts that share a designator on the sheet are numbered #1, #2 ... from top to bottom, then left to right.)
C12#2  100n  [0805C]
C13#2  47u-10V  [3528-SMDB]
C14#2  47u-10V  [3528-SMDB]
C15#2  100n  [0805C]
D1#2  n.m.  [D1206]  (no BOM)
D4#2  SK36  [DO214AB]
R12#2  470R-1%  [1206R]
R26#2  n.m.  [1206R]  (no BOM)
U6#2  LM1117MP-3.3/NOPB  [DCY0004A_L]
VIN_CONNECTOR1#2  61900211121  [61900211121]

### Nets
GND: C12#2.2 C13#2.2 C14#2.2 C15#2.2 R12#2.2 U6#2.1(GND) VIN_CONNECTOR1#2.2
VCAP: R26#2.1
VCC: C14#2.1 C15#2.1 D1#2.2(A) R26#2.2 U6#2.2(OUT) U6#2.4(TAB)
VIN: C12#2.1 C13#2.1 D4#2.1(K) U6#2.3(IN)
NetD1#2_1: D1#2.1(K) R12#2.1
NetD4#2_2: D4#2.2(A) VIN_CONNECTOR1#2.1

### Notes on the sheet
- Tytuł:
- Rozmiar:
- Data:
- A4
- Designed by:
- Czas:
- Część
- z
- (in symbol 47u-10V  3528) 3528
- (in symbol 100n  0805) 0805
- (in symbol 470R-1%  1206) 1206
- (in symbol n.m.  1206) 1206
- (in symbol n.m.  D1206) D1206
- (in symbol SK36  DO214AB) 214AB

### Library data of the parts
C12#2 C15#2 = 100n  0805: as C6#1 on sheet Line_Follower_v4; Nazwa: 100n
C13#2 C14#2 = 47u-10V  3528: as C13#1 on sheet Line_Follower_v4; Nazwa: 47u-10V
D1#2 = n.m.  D1206: Dioda LED; Index: -; Nazwa: n.m.
D4#2 = SK36  DO214AB: as D4#1 on sheet Line_Follower_v4; Nazwa: SK36
R12#2 = 470R-1%  1206: Rezystor 0,25W; Nazwa: 470R-1%
R26#2 = n.m.  1206: Rezystor 0,25W; Indeks: -; Nazwa: n.m.
U6#2 = CMP-0062-01638-4: as U6#1 on sheet Line_Follower_v4; ComponentLink1URL: http://www.ti.com/general/docs/lit/getliterature.tsp?genericPartNumber=LM1117-N&fileType=pdf; PinCount: 4; PackageDescription: Molded SOT-223, 6.50 x 3.56 x 1.6mm Body, 4 Lead, 2.3mm Pitch; Code_IPC: SOT223-4; PartNumber: LM1117MP-3.3/NOPB; Code_JEDEC: TO-261-AA; RoHS: Y; PackageReference: DCY0004A; ComponentLink1Description: Datasheet URL
VIN_CONNECTOR1#2 = CMP-1502-00584-1: as VIN_CONNECTOR1#1 on sheet Line_Follower_v4; Gender: Male; Part Number: 61900211121; Mounting Technology: THT; Operating Temperature: -40to105degC; Orientation: Vertical; Packaging: Bag; Package Reference: 61900211121; Manufacturer URL: http://www.we-online.de; Datasheet URL: https://katalog.we-online.de/em/datasheet/6190xx11121.pdf; Publisher: WurthElektronik

## Nets that join several sheets
GND: Line_Follower_v4 (56 pins), Connectors&Periph (15 pins), Motor_Driver (14 pins), Microcontroller (20 pins), Power (7 pins)
LD1: Line_Follower_v4 (D3#1.1 U5#1.77), Microcontroller (D3#2.1 U5#2.77)
LD2: Line_Follower_v4 (D2#1.1 U5#1.7), Microcontroller (D2#2.1 U5#2.7)
VCAP: Line_Follower_v4 (5 pins), Microcontroller (C28#2.2 C29#2.2 U5#2.48 U5#2.73), Power (R26#2.1)
VCC: Line_Follower_v4 (45 pins), Connectors&Periph (15 pins), Motor_Driver (6 pins), Microcontroller (18 pins), Power (6 pins)
VIN: Line_Follower_v4 (10 pins), Motor_Driver (6 pins), Power (C12#2.1 C13#2.1 D4#2.1 U6#2.3)
ADC1_0: Connectors&Periph (J1#2.2), Microcontroller (U5#2.24)
ADC1_1: Connectors&Periph (J1#2.3), Microcontroller (U5#2.25)
ADC1_2: Connectors&Periph (J1#2.4), Microcontroller (U5#2.28)
ADC1_3: Connectors&Periph (J1#2.5), Microcontroller (U5#2.29)
ADC1_4: Connectors&Periph (J1#2.6), Microcontroller (U5#2.30)
ADC1_5: Connectors&Periph (J1#2.7), Microcontroller (U5#2.31)
ADC1_6: Connectors&Periph (J1#2.8), Microcontroller (U5#2.32)
ADC1_7: Connectors&Periph (J1#2.9), Microcontroller (U5#2.33)
ADC1_8: Connectors&Periph (J1#2.10), Microcontroller (U5#2.34)
ADC1_9: Connectors&Periph (J1#2.11), Microcontroller (U5#2.35)
EEPROM_SCL: Connectors&Periph (C27#2.1 E1#2.6 R14#2.2), Microcontroller (U5#2.95)
EEPROM_SDA: Connectors&Periph (C26#2.1 E1#2.5 R13#2.2), Microcontroller (U5#2.96)
EEPROM_WC: Connectors&Periph (E1#2.7), Microcontroller (U5#2.93)
ENK1_M1: Motor_Driver (U2#2.2), Microcontroller (U5#2.2)
ENK1_M2: Motor_Driver (U1#2.2), Microcontroller (U5#2.64)
ENK2_M1: Motor_Driver (U2#2.3), Microcontroller (U5#2.3)
ENK2_M2: Motor_Driver (U1#2.3), Microcontroller (U5#2.63)
GPIO_1: Connectors&Periph (J1#2.14), Microcontroller (U5#2.41)
GPIO_2: Connectors&Periph (J1#2.15), Microcontroller (U5#2.42)
GPIO_3: Connectors&Periph (J1#2.16), Microcontroller (U5#2.43)
GPIO_4: Connectors&Periph (J1#2.17), Microcontroller (U5#2.44)
IR_PIN: Connectors&Periph (IR_TSOP2236#2.2), Microcontroller (U5#2.1)
LD3: Connectors&Periph (R9#2.2), Microcontroller (U5#2.36)
LD4: Connectors&Periph (R10#2.2), Microcontroller (U5#2.37)
M1_IN1: Motor_Driver (U4#2.9 U4#2.16), Microcontroller (U5#2.5)
M1_IN2: Motor_Driver (U4#2.10 U4#2.15), Microcontroller (U5#2.4)
M2_IN1: Motor_Driver (U3#2.9 U3#2.16), Microcontroller (U5#2.62)
M2_IN2: Motor_Driver (U3#2.10 U3#2.15), Microcontroller (U5#2.61)
MPU_SCL: Connectors&Periph (P2#2.3), Microcontroller (U5#2.59)
MPU_SDA: Connectors&Periph (P2#2.4), Microcontroller (U5#2.60)
SWCLK: Connectors&Periph (J2#2.16 P3#2.3), Microcontroller (U5#2.76)
SWDIO: Connectors&Periph (J2#2.15 P3#2.1), Microcontroller (U5#2.72)
SWO: Connectors&Periph (J2#2.17), Microcontroller (U5#2.89)
UART5_RX: Connectors&Periph (J2#2.19 UART5#2.4), Microcontroller (U5#2.91)
UART5_TX: Connectors&Periph (J2#2.18 UART5#2.5), Microcontroller (U5#2.92)
USART2_RX: Connectors&Periph (J2#2.14), Microcontroller (U5#2.87)
USART2_TX: Connectors&Periph (J2#2.13), Microcontroller (U5#2.86)
uSD_CLK: Connectors&Periph (SDD.5), Microcontroller (U5#2.80)
uSD_CMD: Connectors&Periph (R15#2.2 SDD.3), Microcontroller (U5#2.83)
uSD_D0: Connectors&Periph (R19#2.2 SDD.7), Microcontroller (U5#2.65)
uSD_D1: Connectors&Periph (R18#2.2 SDD.8), Microcontroller (U5#2.66)
uSD_D2: Connectors&Periph (R17#2.2 SDD.1), Microcontroller (U5#2.78)
uSD_D3: Connectors&Periph (R16#2.2 SDD.2), Microcontroller (U5#2.79)